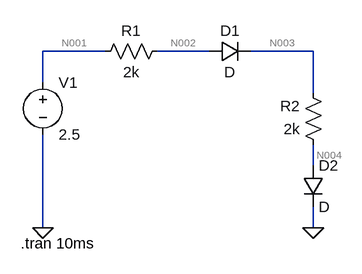
[diagram p0: schematic Draft3.asc]
Draft3.asc, the LTspice schematic file:
Version 4
SHEET 1 880 680
WIRE 192 96 96 96
WIRE 352 96 272 96
WIRE 512 96 416 96
WIRE 96 144 96 96
WIRE 512 160 512 96
WIRE 512 272 512 240
WIRE 96 368 96 224
WIRE 512 368 512 336
FLAG 96 368 0
FLAG 512 368 0
SYMBOL voltage 96 128 R0
WINDOW 123 0 0 Left 0
WINDOW 39 0 0 Left 0
SYMATTR InstName V1
SYMATTR Value 2.5
SYMBOL res 288 80 R90
WINDOW 0 0 56 VBottom 2
WINDOW 3 32 56 VTop 2
SYMATTR InstName R1
SYMATTR Value 2k
SYMBOL res 528 256 R180
WINDOW 0 36 76 Left 2
WINDOW 3 36 40 Left 2
SYMATTR InstName R2
SYMATTR Value 2k
SYMBOL diode 352 112 R270
WINDOW 0 32 32 VTop 2
WINDOW 3 0 32 VBottom 2
SYMATTR InstName D1
SYMBOL diode 496 272 R0
SYMATTR InstName D2
TEXT 62 392 Left 2 !.tran 10ms

The netlist it stands for:
* Draft3.asc
V1 N001 0 2.5
R1 N002 N001 2k
R2 N004 N003 2k
D1 N002 N003 D
D2 N004 0 D
.model D D
.lib standard.dio
.tran 10ms
.backanno
.end

* Results of the author's LTspice run, read from the files saved beside the schematic
* Operating Point, zero values left out:
*   V(n001) = 2.5 V
*   V(n002) = 1.875 V
*   V(n004) = 625 mV
*   V(n003) = 1.25 V
*   I(D2) = 312.5 µA
*   I(D1) = 312.5 µA
*   I(R2) = -312.5 µA
*   I(R1) = -312.5 µA
*   I(V1) = -312.5 µA